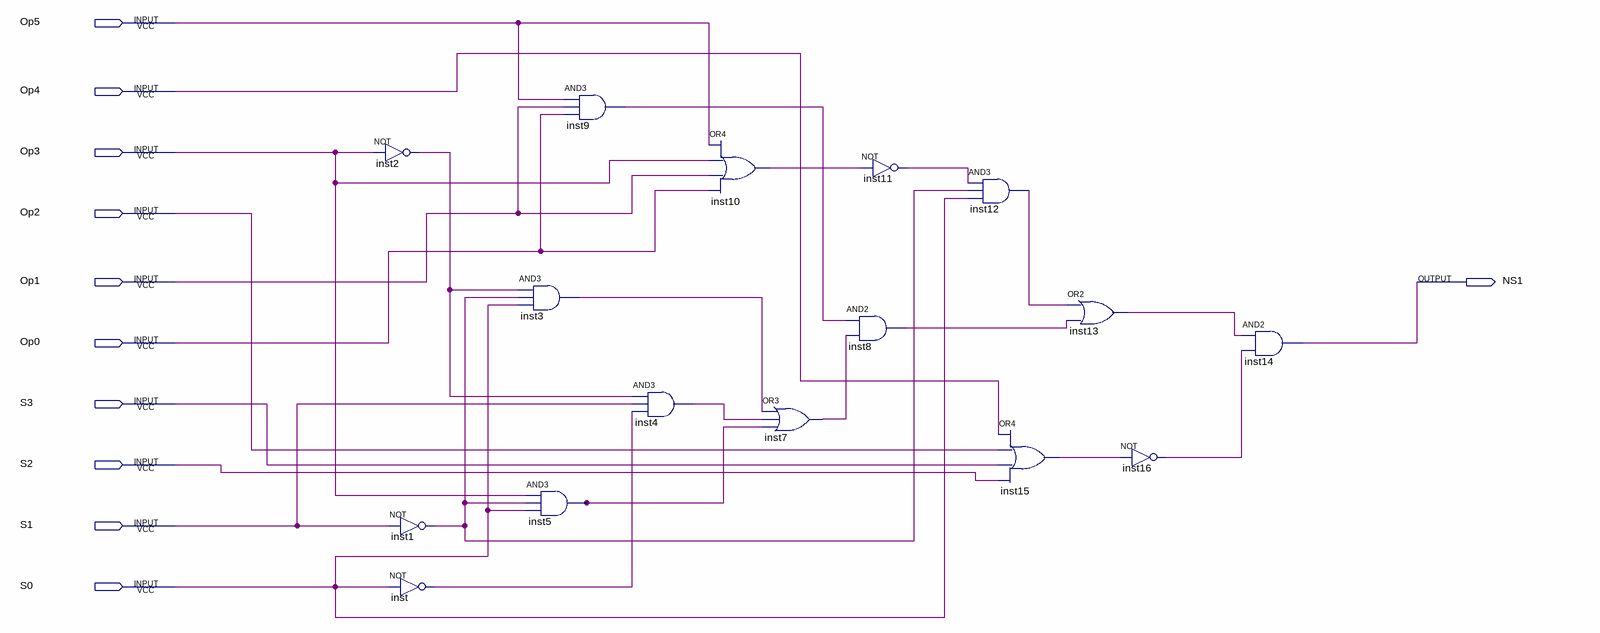
[diagram p0: schematic sheet]
// Quartus schematic NS1.bdf as structural Verilog: 16 symbols, 11 pins
module NS1 (
  input  Op5,
  input  Op4,
  input  Op3,
  input  Op2,
  input  Op1,
  input  Op0,
  input  S3,
  input  S2,
  input  S1,
  input  S0,
  output NS1
);

  wire inst1_out, inst2_out, inst3_out, inst4_out, inst5_out, inst7_out, inst8_out, inst9_out, inst10_out,
       inst11_out, inst12_out, inst13_out, inst15_out, inst16_out, inst_out;

  not inst2 (inst2_out, Op3);
  not inst1 (inst1_out, S1);
  not inst (inst_out, S0);
  and inst3 (inst3_out, inst2_out, inst1_out, S0);
  and inst5 (inst5_out, Op3, inst1_out, S0);
  and inst9 (inst9_out, Op5, Op1, Op0);
  and inst4 (inst4_out, inst2_out, S1, inst_out);
  or inst10 (inst10_out, Op5, Op3, Op1, Op0);
  or inst7 (inst7_out, inst3_out, inst4_out, inst5_out);
  and inst8 (inst8_out, inst9_out, inst7_out);
  not inst11 (inst11_out, inst10_out);
  and inst12 (inst12_out, inst11_out, inst1_out, S0);
  or inst15 (inst15_out, Op4, Op2, S3, S2);
  or inst13 (inst13_out, inst12_out, inst8_out);
  not inst16 (inst16_out, inst15_out);
  and inst14 (NS1, inst13_out, inst16_out);
endmodule
